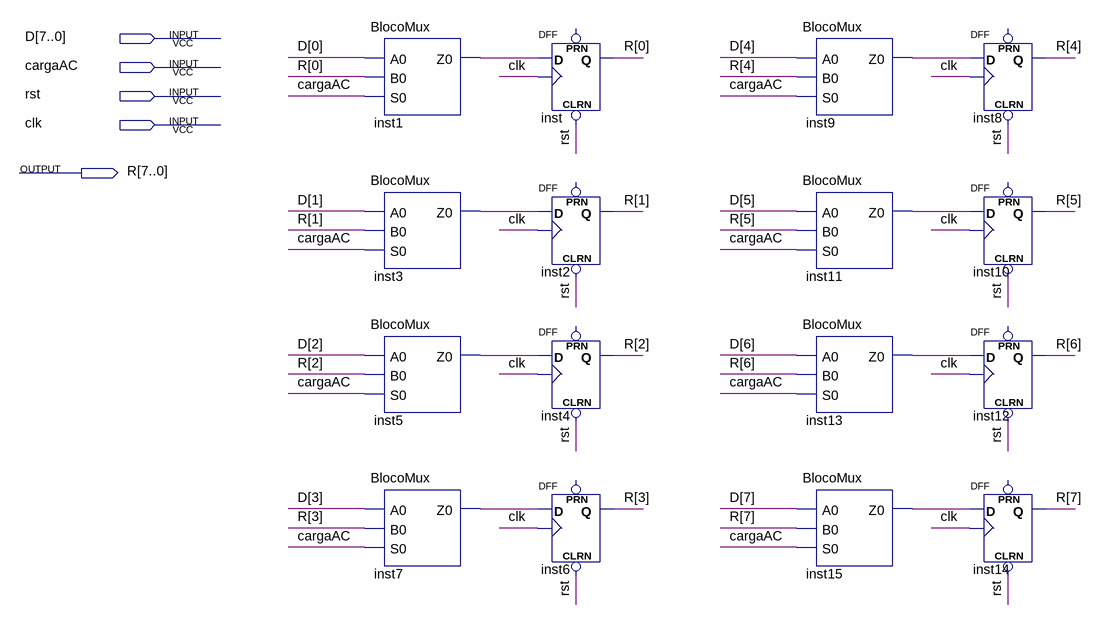
[diagram p0: schematic sheet]
// Quartus schematic AC.bdf as structural Verilog: 16 symbols, 5 pins
module AC (
  input  [7:0] D,
  input  cargaAC,
  input  rst,
  input  clk,
  output [7:0] R
);

  wire inst1_z0, inst3_z0, inst5_z0, inst7_z0, inst9_z0, inst11_z0, inst13_z0, inst15_z0;

  BlocoMux inst1 (.A0(D[0]), .B0(R[0]), .S0(cargaAC), .Z0(inst1_z0));
  BlocoMux inst3 (.A0(D[1]), .B0(R[1]), .S0(cargaAC), .Z0(inst3_z0));
  BlocoMux inst5 (.A0(D[2]), .B0(R[2]), .S0(cargaAC), .Z0(inst5_z0));
  BlocoMux inst7 (.A0(D[3]), .B0(R[3]), .S0(cargaAC), .Z0(inst7_z0));
  DFF inst (.CLRN(rst), .CLK(clk), .D(inst1_z0), .Q(R[0]));  // open: PRN
  DFF inst2 (.CLRN(rst), .CLK(clk), .D(inst3_z0), .Q(R[1]));  // open: PRN
  DFF inst4 (.CLRN(rst), .CLK(clk), .D(inst5_z0), .Q(R[2]));  // open: PRN
  DFF inst6 (.CLRN(rst), .CLK(clk), .D(inst7_z0), .Q(R[3]));  // open: PRN
  BlocoMux inst9 (.A0(D[4]), .B0(R[4]), .S0(cargaAC), .Z0(inst9_z0));
  BlocoMux inst11 (.A0(D[5]), .B0(R[5]), .S0(cargaAC), .Z0(inst11_z0));
  BlocoMux inst13 (.A0(D[6]), .B0(R[6]), .S0(cargaAC), .Z0(inst13_z0));
  BlocoMux inst15 (.A0(D[7]), .B0(R[7]), .S0(cargaAC), .Z0(inst15_z0));
  DFF inst8 (.CLRN(rst), .CLK(clk), .D(inst9_z0), .Q(R[4]));  // open: PRN
  DFF inst10 (.CLRN(rst), .CLK(clk), .D(inst11_z0), .Q(R[5]));  // open: PRN
  DFF inst12 (.CLRN(rst), .CLK(clk), .D(inst13_z0), .Q(R[6]));  // open: PRN
  DFF inst14 (.CLRN(rst), .CLK(clk), .D(inst15_z0), .Q(R[7]));  // open: PRN
endmodule
